# EAGLE design hw6 (EAGLE 9.6.2)
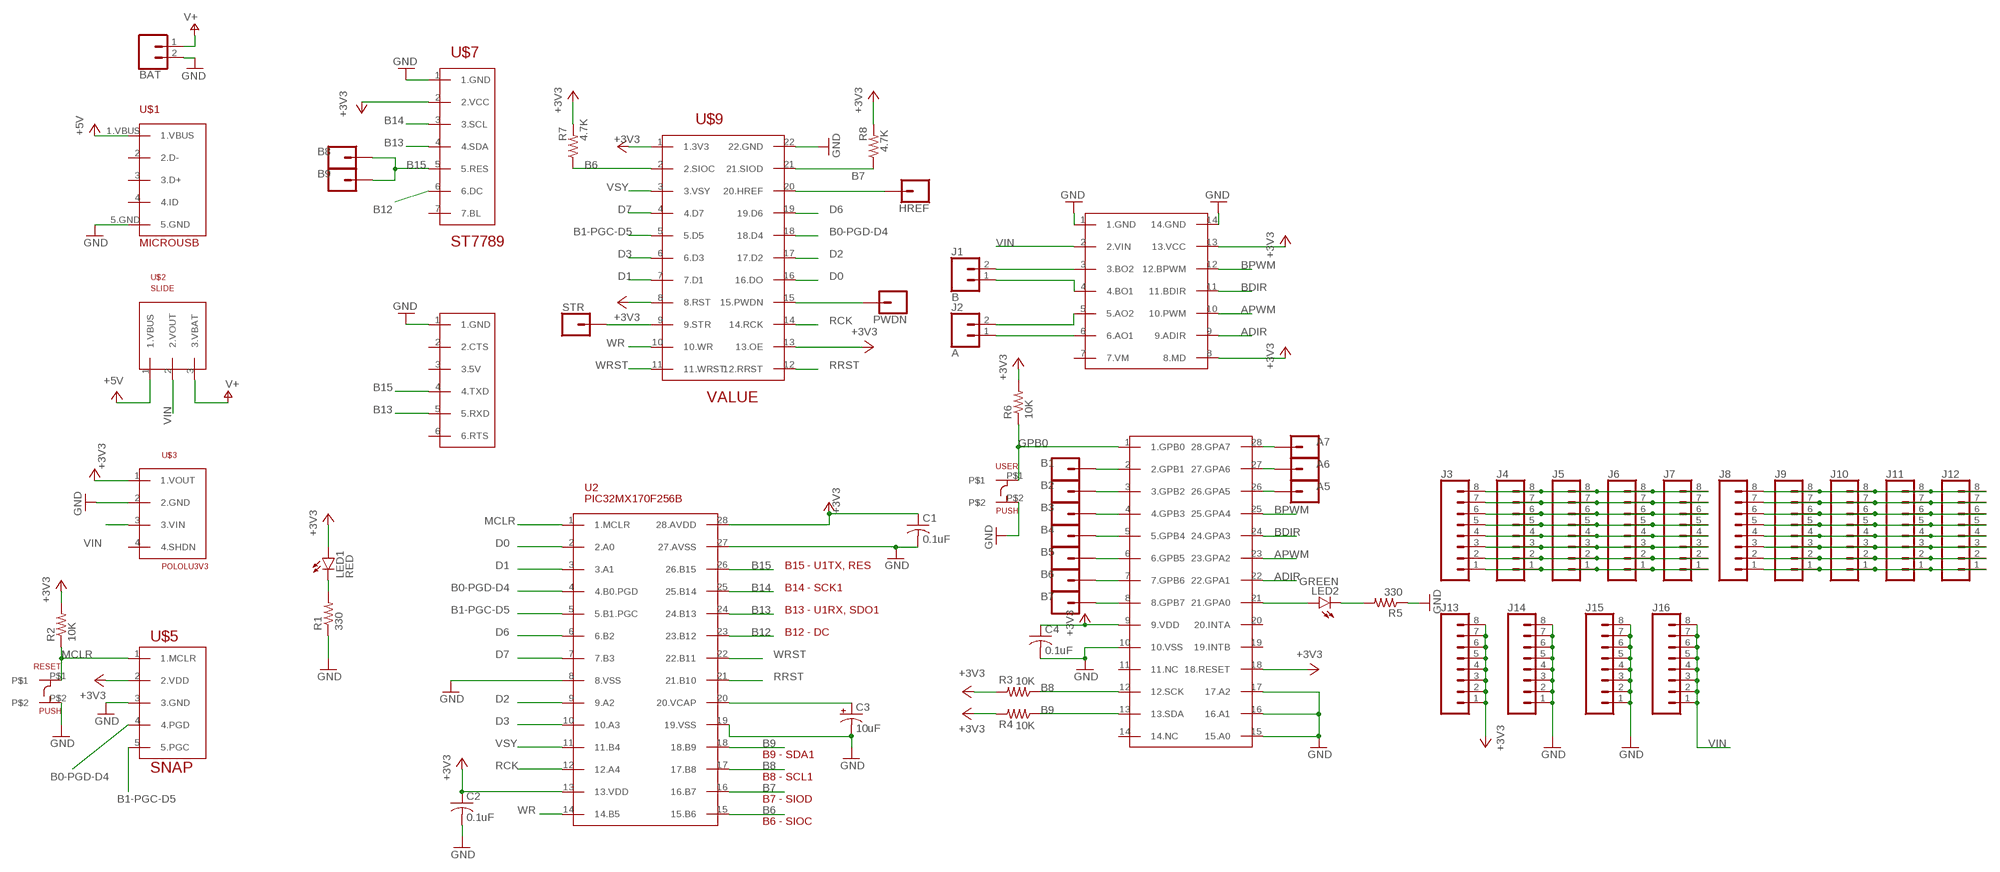
[diagram p0: schematic, sheet 1]

## Parts
A5  CONN_01  [1X01]
A6  CONN_01  [1X01]
A7  CONN_01  [1X01]
B1  CONN_01  [1X01]
B2  CONN_01  [1X01]
B3  CONN_01  [1X01]
B4  CONN_01  [1X01]
B5  CONN_01  [1X01]
B6  CONN_01  [1X01]
B7  CONN_01  [1X01]
B8  CONN_01  [1X01]
B9  CONN_01  [1X01]
BAT  CONN_02  [1X02]
C1  0.1uF  C-US025-030X050  [C025-030X050]
C2  0.1uF  C-US025-030X050  [C025-030X050]
C3  10uF  CPOL-USB45181B  [B45181B]
C4  0.1uF  C-US025-030X050  [C025-030X050]
HREF  CONN_01  [1X01]
J1  B  CONN_02  [1X02]
J2  A  CONN_02  [1X02]
J3  CONN_08"  [1X08]
J4  CONN_08"  [1X08]
J5  CONN_08"  [1X08]
J6  CONN_08"  [1X08]
J7  CONN_08"  [1X08]
J8  CONN_08"  [1X08]
J9  CONN_08"  [1X08]
J10  CONN_08"  [1X08]
J11  CONN_08"  [1X08]
J12  CONN_08"  [1X08]
J13  CONN_08"  [1X08]
J14  CONN_08"  [1X08]
J15  CONN_08"  [1X08]
J16  CONN_08"  [1X08]
LED1  RED  LED3MM  [LED3MM]
LED2  GREEN  LED3MM  [LED3MM]
PWDN  CONN_01  [1X01]
R1  330  R-US_0207/10  [0207/10]
R2  10K  R-US_0207/10  [0207/10]
R3  10K  R-US_0207/10  [0207/10]
R4  10K  R-US_0207/10  [0207/10]
R5  330  R-US_0207/10  [0207/10]
R6  10K  R-US_0207/10  [0207/10]
R7  4.7K  R-US_0207/10  [0207/10]
R8  4.7K  R-US_0207/10  [0207/10]
RESET  PUSH  [PUSH]
STR  CONN_01  [1X01]
U2  PIC32MX170F256B  [DIL28-3]
U$1  MICROUSB  [MICROUSB]
U$2  SLIDE  [SLIDE]
U$3  POLOLU3V3  [POLOLU3V3]
U$4  DRV8835  [DRV8835]
U$5  SNAP  [SNAP]
U$6  CP2104_FRIEND  [CP2104_FRIEND]
U$7  ST7789  [ST7789]
U$8  MCP23017  [DIL28-3]
U$9  OV7670FIFO  [OV7670FIFO]
USER  PUSH  [PUSH]

## Nets
+3V3: C1.1 C2.1 C4.1 J13.1 J13.2 J13.3 J13.4 J13.5 J13.6 J13.7 J13.8 LED1.A R2.2 R3.2 R4.2 R6.2 R7.2 R8.2 U2.13(13.VDD) U2.28(28.AVDD) U$3.1(1.VOUT) U$4.8(8.MD) U$4.13(13.VCC) U$5.2(2.VDD) U$7.2(2.VCC) U$8.9(9.VDD) U$8.18(18.RESET) U$9.1(1.3V3) U$9.8(8.RST) U$9.13(13.OE)
+5V: U$1.1.VBUS U$2.1(1.VBUS)
ADIR: U$4.9(9.ADIR) U$8.22(22.GPA1)
APWM: U$4.10(10.PWM) U$8.23(23.GPA2)
B0-PGD-D4: U2.4(4.B0.PGD) U$5.4(4.PGD) U$9.18(18.D4)
B1-PGC-D5: U2.5(5.B1.PGC) U$5.5(5.PGC) U$9.5(5.D5)
B6: R7.1 U2.15(15.B6) U$9.2(2.SIOC)
B7: R8.1 U2.16(16.B7) U$9.21(21.SIOD)
B8: R3.1 U2.17(17.B8) U$8.12(12.SCK)
B9: R4.1 U2.18(18.B9) U$8.13(13.SDA)
B12: U2.23(23.B12) U$7.6(6.DC)
B13: U2.24(24.B13) U$6.5(5.RXD) U$7.4(4.SDA)
B14: U2.25(25.B14) U$7.3(3.SCL)
B15: B8.1 B9.1 U2.26(26.B15) U$6.4(4.TXD) U$7.5(5.RES)
BDIR: U$4.11(11.BDIR) U$8.24(24.GPA3)
BPWM: U$4.12(12.BPWM) U$8.25(25.GPA4)
D0: U2.2(2.A0) U$9.16(16.DO)
D1: U2.3(3.A1) U$9.7(7.D1)
D2: U2.9(9.A2) U$9.17(17.D2)
D3: U2.10(10.A3) U$9.6(6.D3)
D6: U2.6(6.B2) U$9.19(19.D6)
D7: U2.7(7.B3) U$9.4(4.D7)
GND: BAT.2 C1.2 C2.2 C3.- C4.2 J14.1 J14.2 J14.3 J14.4 J14.5 J14.6 J14.7 J14.8 J15.1 J15.2 J15.3 J15.4 J15.5 J15.6 J15.7 J15.8 R1.1 R5.1 RESET.P$2 U2.8(8.VSS) U2.19(19.VSS) U2.27(27.AVSS) U$1.5.GND U$3.2(2.GND) U$4.1(1.GND) U$4.14(14.GND) U$5.3(3.GND) U$6.1(1.GND) U$7.1(1.GND) U$8.10(10.VSS) U$8.15(15.A0) U$8.16(16.A1) U$8.17(17.A2) U$9.22(22.GND) USER.P$2
GPB0: R6.1 U$8.1(1.GPB0) USER.P$1
MCLR: R2.1 RESET.P$1 U2.1(1.MCLR) U$5.1(1.MCLR)
N$1: LED1.K(C) R1.2
N$2: C3.+ U2.20(20.VCAP)
N$3: LED2.K(C) R5.2
N$4: LED2.A U$8.21(21.GPA0)
N$5: J1.2 U$4.3(3.BO2)
N$6: J1.1 U$4.4(4.BO1)
N$7: J2.2 U$4.5(5.AO2)
N$8: J2.1 U$4.6(6.AO1)
N$9: STR.1 U$9.9(9.STR)
N$10: HREF.1 U$9.20(20.HREF)
N$11: PWDN.1 U$9.15(15.PWDN)
N$12: B1.1 U$8.2(2.GPB1)
N$13: B2.1 U$8.3(3.GPB2)
N$14: B3.1 U$8.4(4.GPB3)
N$15: B4.1 U$8.5(5.GPB4)
N$16: B5.1 U$8.6(6.GPB5)
N$17: B6.1 U$8.7(7.GPB6)
N$18: B7.1 U$8.8(8.GPB7)
N$19: A7.1 U$8.28(28.GPA7)
N$20: A6.1 U$8.27(27.GPA6)
N$21: A5.1 U$8.26(26.GPA5)
N$22: J3.8 J4.8 J5.8 J6.8 J7.8
N$23: J3.7 J4.7 J5.7 J6.7 J7.7
N$24: J3.6 J4.6 J5.6 J6.6 J7.6
N$25: J3.5 J4.5 J5.5 J6.5 J7.5
N$26: J3.4 J4.4 J5.4 J6.4 J7.4
N$27: J3.3 J4.3 J5.3 J6.3 J7.3
N$28: J3.2 J4.2 J5.2 J6.2 J7.2
N$29: J3.1 J4.1 J5.1 J6.1 J7.1
N$30: J8.8 J9.8 J10.8 J11.8 J12.8
N$31: J8.7 J9.7 J10.7 J11.7 J12.7
N$32: J8.6 J9.6 J10.6 J11.6 J12.6
N$33: J8.5 J9.5 J10.5 J11.5 J12.5
N$34: J8.4 J9.4 J10.4 J11.4 J12.4
N$35: J8.3 J9.3 J10.3 J11.3 J12.3
N$36: J8.2 J9.2 J10.2 J11.2 J12.2
N$37: J8.1 J9.1 J10.1 J11.1 J12.1
RCK: U2.12(12.A4) U$9.14(14.RCK)
RRST: U2.21(21.B10) U$9.12(12.RRST)
V+: BAT.1 U$2.3(3.VBAT)
VIN: J16.1 J16.2 J16.3 J16.4 J16.5 J16.6 J16.7 J16.8 U$2.2(2.VOUT) U$3.3(3.VIN) U$4.2(2.VIN)
VSY: U2.11(11.B4) U$9.3(3.VSY)
WR: U2.14(14.B5) U$9.10(10.WR)
WRST: U2.22(22.B11) U$9.11(11.WRST)
Unconnected: U$1.2(2.D-) U$1.3(3.D+) U$1.4(4.ID) U$3.4(4.SHDN) U$4.7(7.VM) U$6.2(2.CTS) U$6.3(3.5V) U$6.6(6.RTS) U$7.7(7.BL) U$8.11(11.NC) U$8.14(14.NC) U$8.19(19.INTB) U$8.20(20.INTA)

## Notes on the sheet
- B15 - U1TX, RES
- B14 - SCK1
- B13 - U1RX, SDO1
- B12 - DC
- B9 - SDA1
- B8 - SCL1
- B7 - SIOD
- B6 - SIOC

## Library data of the parts
A5-A7 B1-B9 HREF PWDN STR = ME433:CONN_01: Single connection point. Often used as Generic Header-pin footprint for 0.1 inch spaced/style header connections On any of the 0.1 inch spaced packages, you can populate with these: Break Away Headers - Straight <https://www.sparkfun.com/products/116> (PRT-00116) Break Away Male Headers - Right Angle <https://www.sparkfun.com/products/553> (PRT-00553) Female Headers <https://www.sparkfun.com/products/115> (PRT-00115) Break Away Headers - Machine Pin <https://www.sparkfun.com/products/117> (PRT-00117) Break Away Female Headers - Swiss Machine Pin <https://www.sparkfun.com/products/743> (PRT-00743) This device is also useful as a general connection point to wire up your design to another part of your project. Our various solder wires solder well into these plated through hole pads. Hook-Up Wire - Assortment (Stranded, 22 AWG) <https://www.sparkfun.com/products/11375> (PRT-11375) Hook-Up Wire - Assortment (Solid Core, 22 AWG) <https://www.sparkfun.com/products/11367> (PRT-11367) View the entire wire category on our website here <https://www.sparkfun.com/categories/141> Special notes: SMTSO-256-ET is a "flush mount" nut for a 4-40 screw. We mostly use this on specialty testbeds; it is a nice way to connect hardware to your PCB at an adjustable hieght. Also note, the SNAP packages are for using a snappable style connector. We sell a baggie of snaps and they are also used on two LilyPad designs: Snap Assortment - 30 pack (male and female) <https://www.sparkfun.com/products/11347> (DEV-11347) LilyPad Arduino SimpleSnap <https://www.sparkfun.com/products/10941> (DEV-10941) LilyPad SimpleSnap Protoboard <https://www.sparkfun.com/products/10940> (DEV-10940)
BAT J1 J2 = ME433:CONN_02: Multi connection point. Often used as Generic Header-pin footprint for 0.1 inch spaced/style header connections On any of the 0.1 inch spaced packages, you can populate with these: Break Away Headers - Straight <https://www.sparkfun.com/products/116> (PRT-00116) Break Away Male Headers - Right Angle <https://www.sparkfun.com/products/553> (PRT-00553) Female Headers <https://www.sparkfun.com/products/115> (PRT-00115) Break Away Headers - Machine Pin <https://www.sparkfun.com/products/117> (PRT-00117) Break Away Female Headers - Swiss Machine Pin <https://www.sparkfun.com/products/743> (PRT-00743) For SCREWTERMINALS and SPRING TERMINALS visit here: Screw Terimnals on SparkFun.com <https://www.sparkfun.com/search/results?term=Screw+Terminals> (5mm/3.5mm/2.54mm spacing) This device is also useful as a general connection point to wire up your design to another part of your project. Our various solder wires solder well into these plated through hole pads. Hook-Up Wire - Assortment (Stranded, 22 AWG) <https://www.sparkfun.com/products/11375> (PRT-11375) Hook-Up Wire - Assortment (Solid Core, 22 AWG) <https://www.sparkfun.com/products/11367> (PRT-11367) View the entire wire category on our website here <https://www.sparkfun.com/categories/141> Special notes: Molex polarized connector foot print use with: PRT-08233 with associated crimp pins and housings. 2.54_SCREWTERM for use with PRT-10571. 3.5mm Screw Terminal footprints for PRT-08084 5mm Screw Terminal footprints for use with PRT-08432
C1 C2 C4 = ME433:C-US: CAPACITOR, American symbol; SPICEPREFIX: C
C3 = ME433:CPOL-US: POLARIZED CAPACITOR, American symbol; SPICEPREFIX: C
J3-J16 = ME433:CONN_08: Multi connection point. Often used as Generic Header-pin footprint for 0.1 inch spaced/style header connections On any of the 0.1 inch spaced packages, you can populate with these: Break Away Headers - Straight <https://www.sparkfun.com/products/116> (PRT-00116) Break Away Male Headers - Right Angle <https://www.sparkfun.com/products/553> (PRT-00553) Female Headers <https://www.sparkfun.com/products/115> (PRT-00115) Break Away Headers - Machine Pin <https://www.sparkfun.com/products/117> (PRT-00117) Break Away Female Headers - Swiss Machine Pin <https://www.sparkfun.com/products/743> (PRT-00743) Arduino Stackable Header - 8 Pin <https://www.sparkfun.com/products/9279> (PRT-09279) For SCREWTERMINALS and SPRING TERMINALS visit here: Screw Terimnals on SparkFun.com <https://www.sparkfun.com/search/results?term=Screw+Terminals> (5mm/3.5mm/2.54mm spacing) This device is also useful as a general connection point to wire up your design to another part of your project. Our various solder wires solder well into these plated through hole pads. Hook-Up Wire - Assortment (Stranded, 22 AWG) <https://www.sparkfun.com/products/11375> (PRT-11375) Hook-Up Wire - Assortment (Solid Core, 22 AWG) <https://www.sparkfun.com/products/11367> (PRT-11367) View the entire wire category on our website here <https://www.sparkfun.com/categories/141> Special notes: Molex polarized connector foot print use with SKU : PRT-08231 with associated crimp pins and housings. 1MM SMD Version SKU: PRT-10208 NOTES ON THE VARIANTS LOCK and LOCK_LONGPADS... This footprint was designed to help hold the alignment of a through-hole component (i.e. 6-pin header) while soldering it into place. You may notice that each hole has been shifted either up or down by 0.005 of an inch from it's more standard position (which is a perfectly straight line). This slight alteration caused the pins (the squares in the middle) to touch the edges of the holes. Because they are alternating, it causes a "brace" to hold the component in place. 0.005 has proven to be the perfect amount of "off-center" position when using our standard breakaway headers. Although looks a little odd when you look at the bare footprint, once you have a header in there, the alteration is very hard to notice. Also,if you push a header all the way into place, it is covered up entirely on the bottom side.; PROD_ID: CONN-08438
LED1 LED2 = ME433:LED: LED OSRAM: - CHIPLED LG R971, LG N971, LY N971, LG Q971, LY Q971, LO R971, LY R971 LH N974, LH R974 LS Q976, LO Q976, LY Q976 LO Q996 - Hyper CHIPLED LW Q18S LB Q993, LB Q99A, LB R99A - SideLED LS A670, LO A670, LY A670, LG A670, LP A670 LB A673, LV A673, LT A673, LW A673 LH A674 LY A675 LS A676, LA A676, LO A676, LY A676, LW A676 LS A679, LY A679, LG A679 - Hyper Micro SIDELED® LS Y876, LA Y876, LO Y876, LY Y876 LT Y87S - SmartLED LW L88C, LW L88S LB L89C, LB L89S, LG L890 LS L89K, LO L89K, LY L89K LS L896, LA L896, LO L896, LY L896 - TOPLED LS T670, LO T670, LY T670, LG T670, LP T670 LSG T670, LSP T670, LSY T670, LOP T670, LYG T670 LG T671, LOG T671, LSG T671 LB T673, LV T673, LT T673, LW T673 LH T674 LS T676, LA T676, LO T676, LY T676, LB T676, LH T676, LSB T676, LW T676 LB T67C, LV T67C, LT T67C, LS T67K, LO T67K, LY T67K, LW E67C LS E67B, LA E67B, LO E67B, LY E67B, LB E67C, LV E67C, LT E67C LW T67C LS T679, LY T679, LG T679 LS T770, LO T770, LY T770, LG T770, LP T770 LB T773, LV T773, LT T773, LW T773 LH T774 LS E675, LA E675, LY E675, LS T675 LS T776, LA T776, LO T776, LY T776, LB T776 LHGB T686 LT T68C, LB T68C - Hyper Mini TOPLED® LB M676 - Mini TOPLED Santana® LG M470 LS M47K, LO M47K, LY M47K Source: http://www.osram.convergy.de LUXEON: - LUMILED® LXK2-PW12-R00, LXK2-PW12-S00, LXK2-PW14-U00, LXK2-PW14-V00 LXK2-PM12-R00, LXK2-PM12-S00, LXK2-PM14-U00 LXK2-PE12-Q00, LXK2-PE12-R00, LXK2-PE12-S00, LXK2-PE14-T00, LXK2-PE14-U00 LXK2-PB12-K00, LXK2-PB12-L00, LXK2-PB12-M00, LXK2-PB14-N00, LXK2-PB14-P00, LXK2-PB14-Q00 LXK2-PR12-L00, LXK2-PR12-M00, LXK2-PR14-Q00, LXK2-PR14-R00 LXK2-PD12-Q00, LXK2-PD12-R00, LXK2-PD12-S00 LXK2-PH12-R00, LXK2-PH12-S00 LXK2-PL12-P00, LXK2-PL12-Q00, LXK2-PL12-R00 Source: www.luxeon.com KINGBRIGHT: KA-3528ASYC Source: www.kingbright.com
R1-R8 = ME433:R-US_: RESISTOR, American symbol; SPICEPREFIX: R
RESET USER = ME433:PUSH
U2 = ME433:PIC32MX170F256B
U$1 = ME433:MICROUSB
U$2 = ME433:SLIDE
U$3 = ME433:POLOLU3V3
U$4 = ME433:DRV8835
U$5 = ME433:SNAP
U$6 = ME433:CP2104_FRIEND
U$7 = ME433:ST7789
U$8 = ME433:MCP23017
U$9 = ME433:OV7670FIFO

## Board
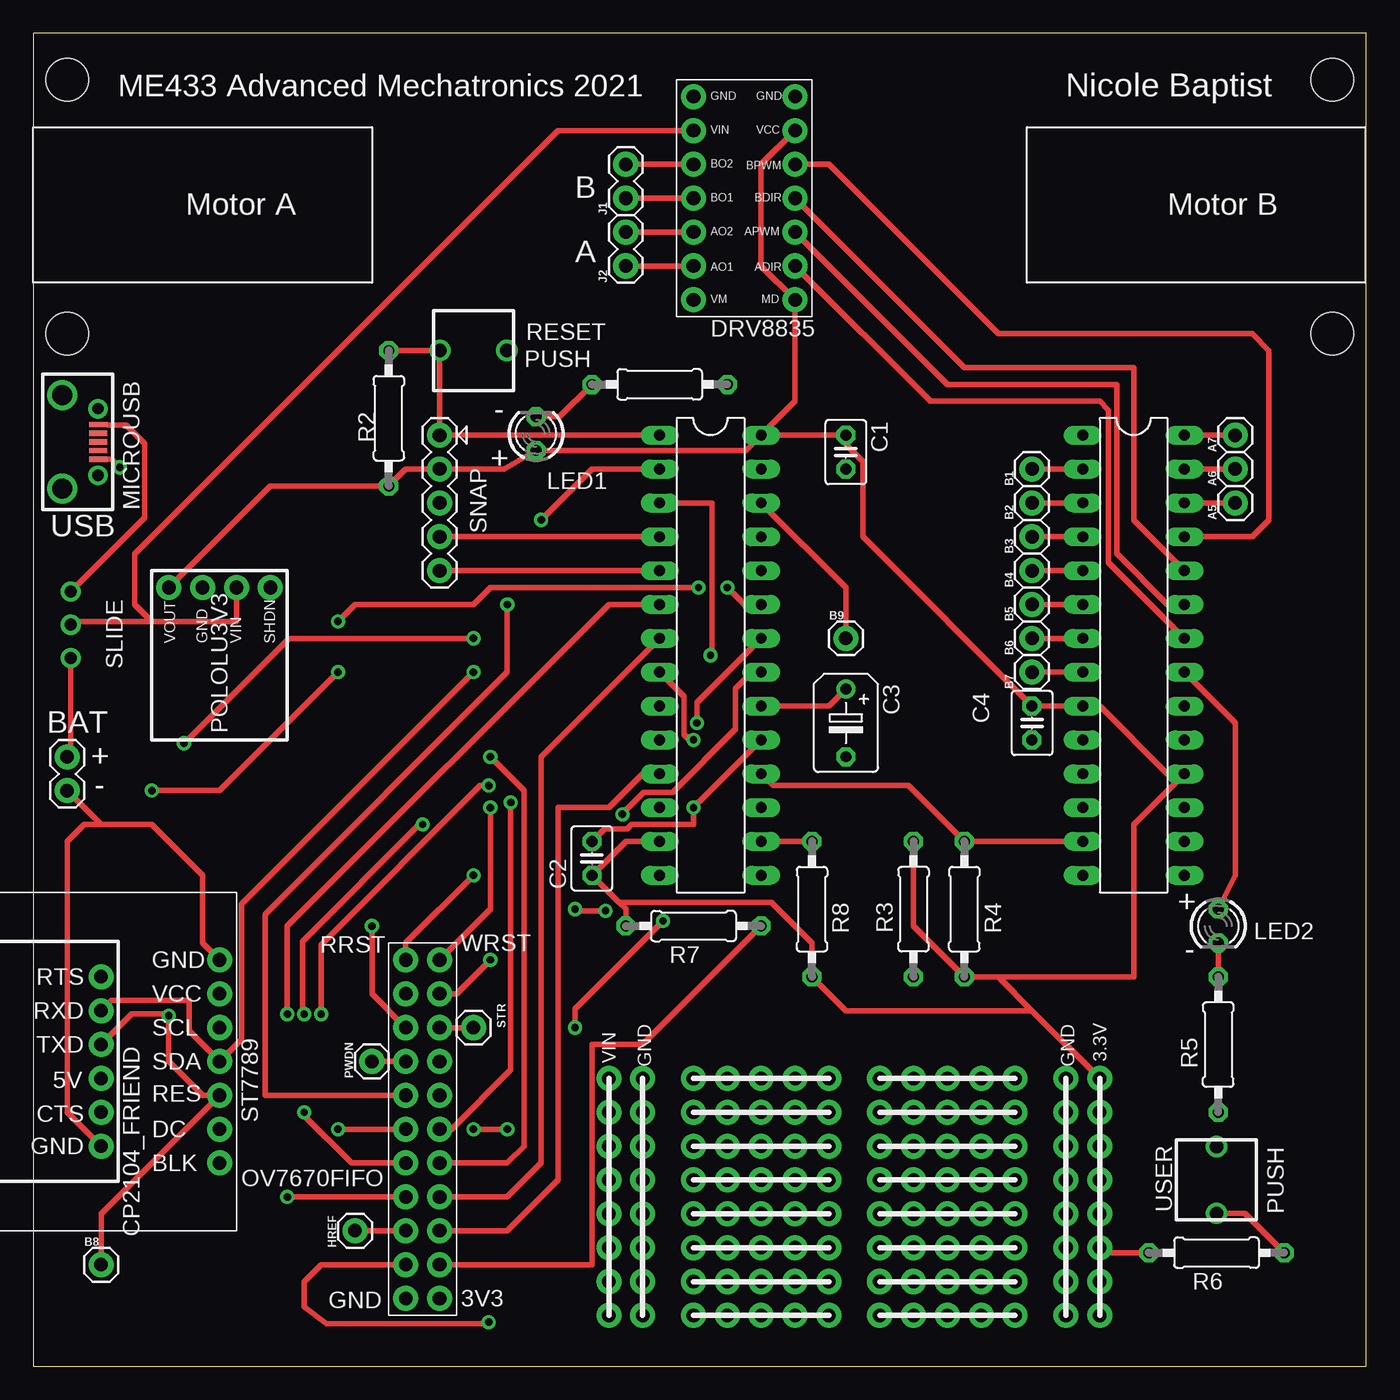
[diagram p1: board, top side]
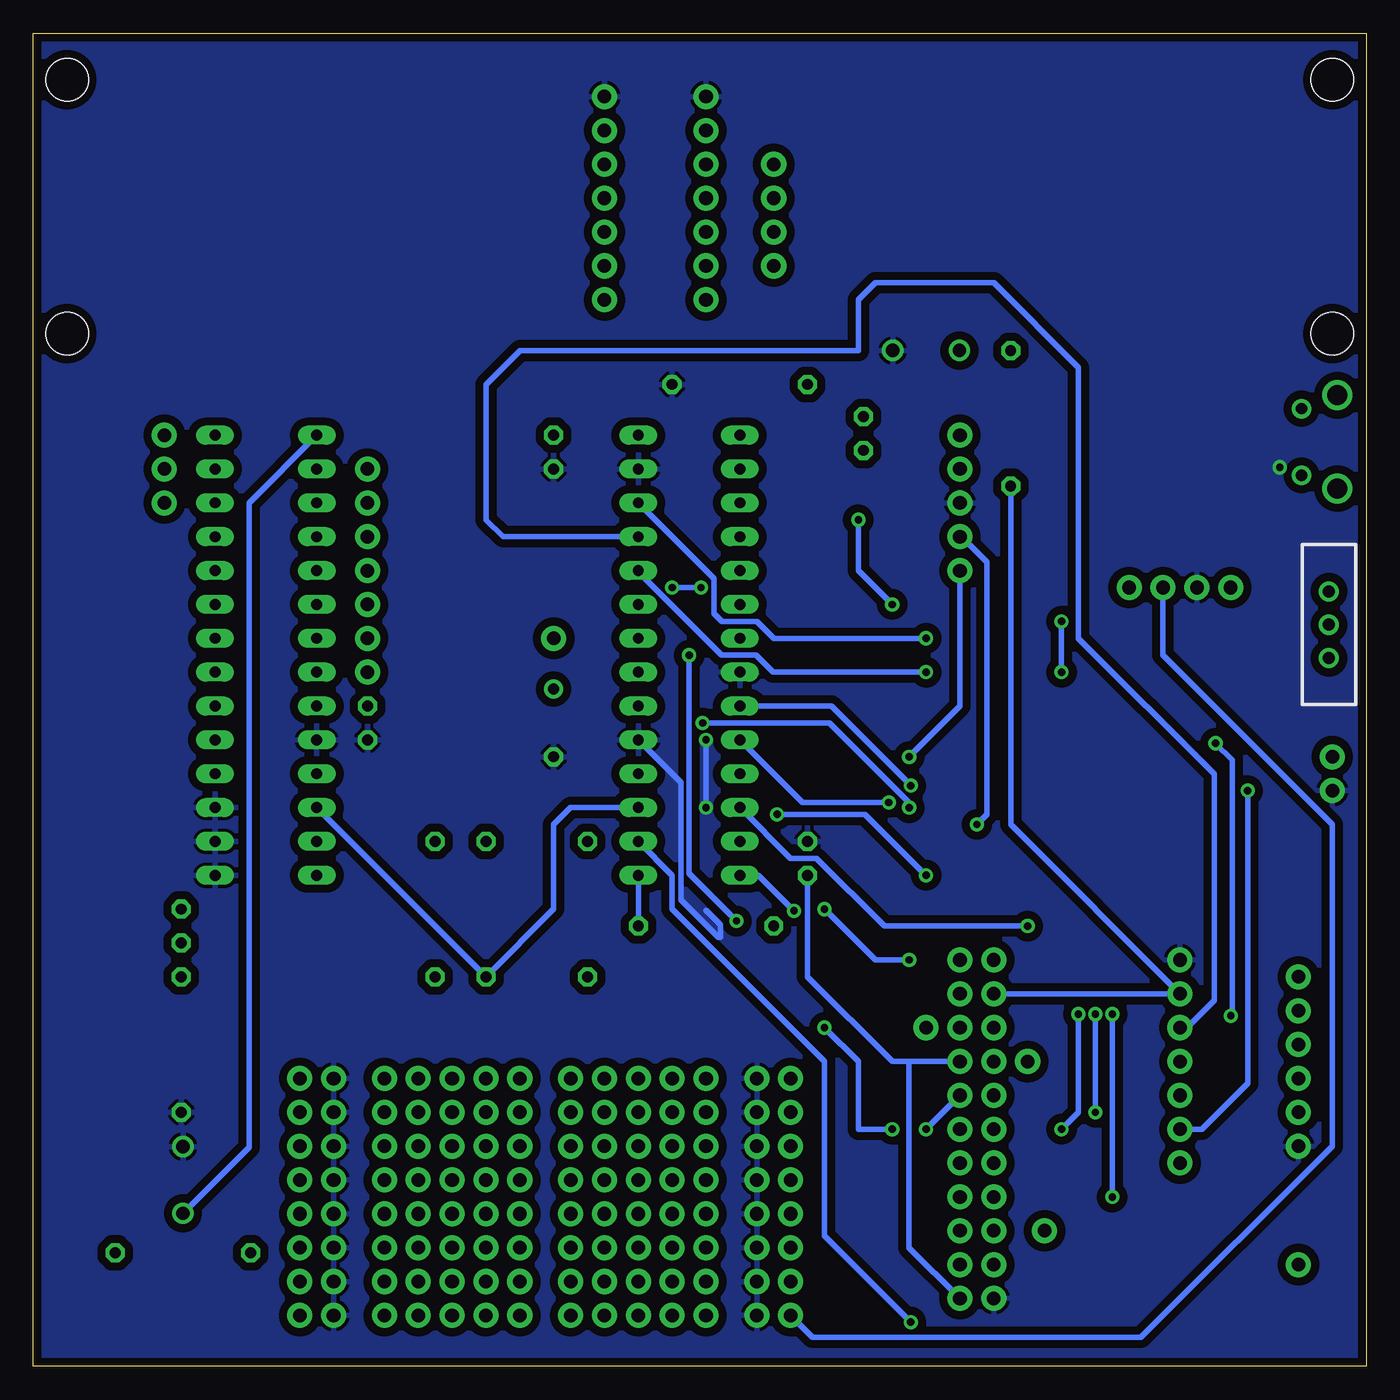
[diagram p2: board, bottom side, seen from below]

Size 100 x 100 mm. Coordinates in mm from the lower left corner, seen from the top.
Outline: 0,0 100,0 100,100 0,100 0,0
Copper layers (1*16): Top 0.035mm / dielectric 1.5mm / Bottom 0.035mm
Design rules "SparkFun": minimum track width 8mil, minimum drill 20mil, track to track 8mil, track to pad 8mil, pad to pad 8mil, via to via 8mil, smd to smd 8mil, copper to edge 8mil, drill to drill 8mil, minimum pad ring 12mil, minimum via ring 10mil, stop-mask expansion 4mil, vias tented up to drill 20mil, thermal gap 10mil
Holes 3.17 mm at 2.54,96.52 2.54,77.47 97.46,96.52 97.46,77.47

### Footprints (pad centres in the part's own frame; a part is rotated, then mirrored left to right if it is on the bottom)
1X01 = drill 1.016 pad 1.88: 1 0,0
1X02 = drill 1.016 pad 1.88: 1 0,0; 2 2.54,0
C025-030X050 = drill 0.813 octagon: 1 -1.27,0; 2 1.27,0
B45181B = drill 0.813: + -2.54,0 | drill 0.813 octagon: - 2.54,0
1X08 = drill 1.016 pad 1.88: 1 0,0; 2 2.54,0; 3 5.08,0; 4 7.62,0; 5 10.16,0; 6 12.7,0; 7 15.24,0; 8 17.78,0
LED3MM = drill 0.813 octagon: A -1.27,0; K 1.27,0
0207/10 = drill 0.813 octagon: 1 -5.08,0; 2 5.08,0
PUSH = drill 1: P$1 -2.5,0; P$2 2.5,0
DIL28-3 = drill 0.813 long: 1 -16.51,-3.81; 2 -13.97,-3.81; 3 -11.43,-3.81; 4 -8.89,-3.81; 5 -6.35,-3.81; 6 -3.81,-3.81; 7 -1.27,-3.81; 8 1.27,-3.81; 9 3.81,-3.81; 10 6.35,-3.81; 11 8.89,-3.81; 12 11.43,-3.81; 13 13.97,-3.81; 14 16.51,-3.81; 15 16.51,3.81; 16 13.97,3.81; 17 11.43,3.81; 18 8.89,3.81; 19 6.35,3.81; 20 3.81,3.81; 21 1.27,3.81; 22 -1.27,3.81; 23 -3.81,3.81; 24 -6.35,3.81; 25 -8.89,3.81; 26 -11.43,3.81; 27 -13.97,3.81; 28 -16.51,3.81
MICROUSB = smd 0.4 x 1.35: 1.VBUS -1.3,2.7; 2 -0.65,2.7; 3 0,2.7; 4 0.65,2.7; 5.GND 1.3,2.7 | drill 0.85: P$6 -2.5,2.7; P$7 2.5,2.7 | drill 1.5: P$8 -3.5,0; P$9 3.5,0
SLIDE = drill 0.9: 1 -2.5,0; 2 0,0; 3 2.5,0
POLOLU3V3 = drill 1.016 pad 1.88: 1 0,3.81; 2 0,1.27; 3 0,-1.27; 4 0,-3.81
DRV8835 = drill 1.016 pad 1.88: 1 -3.81,7.62; 2 -3.81,5.08; 3 -3.81,2.54; 4 -3.81,0; 5 -3.81,-2.54; 6 -3.81,-5.08; 7 -3.81,-7.62; 8 3.81,-7.62; 9 3.81,-5.08; 10 3.81,-2.54; 11 3.81,0; 12 3.81,2.54; 13 3.81,5.08; 14 3.81,7.62
SNAP = drill 1.016 pad 1.88: 1 0,5.08; 2 0,2.54; 3 0,0; 4 0,-2.54; 5 0,-5.08
CP2104_FRIEND = drill 1.016 pad 1.88: 1 -12.7,21.59; 2 -12.7,19.05; 3 -12.7,16.51; 4 -12.7,13.97; 5 -12.7,11.43; 6 -12.7,8.89
ST7789 = drill 1.016 pad 1.88: 1 0,7.62; 2 0,5.08; 3 0,2.54; 4 0,0; 5 0,-2.54; 6 0,-5.08; 7 0,-7.62
OV7670FIFO = drill 1.016 pad 1.88: 1 -3.81,12.7; 2 -3.81,10.16; 3 -3.81,7.62; 4 -3.81,5.08; 5 -3.81,2.54; 6 -3.81,0; 7 -3.81,-2.54; 8 -3.81,-5.08; 9 -3.81,-7.62; 10 -3.81,-10.16; 11 -3.81,-12.7; 12 -1.27,-12.7; 13 -1.27,-10.16; 14 -1.27,-7.62; 15 -1.27,-5.08; 16 -1.27,-2.54; 17 -1.27,0; 18 -1.27,2.54; 19 -1.27,5.08; 20 -1.27,7.62; 21 -1.27,10.16; 22 -1.27,12.7

### Placement (x,y rotation side)
A5  90.17,64.77 90 top
A6  90.17,67.31 90 top
A7  90.17,69.85 90 top
B1  74.93,67.31 90 top
B2  74.93,64.77 90 top
B3  74.93,62.23 90 top
B4  74.93,59.69 90 top
B5  74.93,57.15 90 top
B6  74.93,54.61 90 top
B7  74.93,52.07 90 top
B8  5.08,7.62 0 top
B9  60.96,54.61 0 top
BAT  2.54,45.72 270 top
C1  60.96,68.58 270 top
C2  41.91,38.1 90 top
C3  60.96,48.26 270 top
C4  74.93,48.26 270 top
HREF  24.13,10.16 90 top
J1  44.45,87.63 90 top
J2  44.45,82.55 90 top
J3  49.53,3.81 90 top
J4  52.07,3.81 90 top
J5  54.61,3.81 90 top
J6  57.15,3.81 90 top
J7  59.69,3.81 90 top
J8  63.5,3.81 90 top
J9  66.04,3.81 90 top
J10  68.58,3.81 90 top
J11  71.12,3.81 90 top
J12  73.66,3.81 90 top
J13  80.01,21.59 270 top
J14  77.47,21.59 270 top
J15  45.72,21.59 270 top
J16  43.18,3.81 90 top
LED1  37.72,69.98 90 top
LED2  88.9,33.02 270 top
PWDN  25.4,22.86 90 top
R1  46.99,73.66 180 top
R2  26.67,71.12 270 top
R3  66.04,34.29 90 top
R4  69.85,34.29 270 top
R5  88.9,24.13 90 top
R6  88.77,8.51 180 top
R7  49.53,33.02 180 top
R8  58.42,34.29 270 top
RESET  33.02,76.2 0 top
STR  33.02,25.4 90 top
U2  50.8,53.34 270 top
U$1  2.16,69.34 270 top
U$2  2.79,55.63 270 bottom
U$3  13.97,58.42 90 top
U$4  53.34,87.63 0 top
U$5  30.48,64.77 0 top
U$6  -7.62,38.1 180 top
U$7  13.97,22.86 0 top
U$8  82.55,53.34 270 top
U$9  26.67,17.78 180 top
USER  88.77,13.97 90 top

### Tracks (layer width: path | path; a pad name or v marks a point on that pad's centre or on a via)
+3V3
  Top 0.406: U$3.1 17.78,66.04 R2.2 27.94,67.31 U$5.2 35.31,67.31 LED1.A 53.47,68.71 U2.28 | U2.28 C1.1 60.96,69.13 62.23,67.86 62.23,62.23 C4.1 U$8.9 80.01,49.53 85.09,44.45 U$8.18 82.55,40.64 82.55,29.21 R4.2 | U2.28 57.15,72.39 U$4.8 54.61,82.55 54.61,90.17 U$4.13 | R3.2 66.04,33.02 R4.2 | R4.2 72.39,29.21 74.93,26.67 | 74.93,26.67 J13.1 J13.2 J13.3 J13.4 J13.5 J13.6 | R6.2 80.39,8.51 J13.6 | 43.94,34.8 C2.1 44.45,39.37 U2.13 | 43.94,34.8 44.45,34.29 R7.2 | 43.94,34.8 55.37,34.8 58.42,31.75 R8.2 60.96,26.67 74.93,26.67 | J13.6 J13.7 J13.8
  Bottom 0.406: C2.1 41.91,29.21 35.56,22.86 34.29,22.86 | 34.29,22.86 U$9.8 | U$9.1 34.29,8.89 34.29,22.86 | R2.2 26.67,40.64 U$7.2 U$9.13
+5V
  Top 0.406: U$2.1 8.35,63.69 8.35,69.22 6.97,70.6 5.6,70.6 5.56,70.64 U$1.1.VBUS
ADIR
  Top 0.406: U$8.22 80.67,60.3 80.67,71.73 80.01,72.39 67.31,72.39 U$4.9
APWM
  Top 0.406: U$8.23 85.09,57.15 81.28,60.96 81.28,73.66 68.58,73.66 U$4.10
B0-PGD-D4  (via drill 0.55)
  Top 0.406: U$5.4 U2.4 | U$9.18 23.88,15.24 20.32,18.8 v20.32,19.05 | v20.32,26.42 20.19,26.54 20.19,31.88 28.96,40.64 v29.21,40.64
  Bottom 0.406: v20.32,26.42 v20.32,19.05 | v29.21,40.64 28.45,41.4 28.45,60.33 30.35,62.23 U$5.4
B1-PGC-D5  (via drill 0.55)
  Top 0.406: U2.5 U$5.5 | U$9.5 35.56,15.24 36.83,16.51 36.83,43.18 v34.29,45.72
  Bottom 0.406: v34.29,45.72 30.48,49.53 U$5.5
B6
  Top 0.406: R7.1 45.72,24.13 41.91,24.13 41.91,7.62 U$9.2
  Bottom 0.406: U2.15 R7.1
B7  (via drill 0.55)
  Top 0.406: U2.16 R8.1 | v34.16,3.3 34.04,3.17 22.01,3.17 20.32,4.45 20.32,6.35 21.59,7.62 U$9.21
  Bottom 0.406: U2.16 52.07,36.83 52.07,34.29 40.64,22.86 40.64,9.78 v34.16,3.3
B8
  Bottom 0.406: U$8.12 R3.1 60.96,34.29 60.96,40.64 59.69,41.91 U2.17
B9
  Top 0.406: U2.18 55.5,43.56 65.66,43.56 R4.1 U$8.13
B12  (via drill 0.55)
  Top 0.406: v8.89,43.18 13.97,43.18 v22.86,52.07 | v22.86,55.88 24.13,57.15 33.02,57.15 34.29,58.42 v49.91,58.42 | v52.07,58.42 53.34,57.15 U2.23
  Bottom 0.406: U$7.6 12.32,17.78 8.89,21.21 v8.89,43.18 | v22.86,52.07 v22.86,55.88 | v49.91,58.42 v52.07,58.42
B13  (via drill 0.55)
  Top 0.406: U$6.5 5.84,27.43 11.68,27.43 11.68,25.15 U$7.4 15.65,24.54 15.65,34.7 v33.02,52.07
  Bottom 0.406: U2.24 54.61,59.56 48.39,53.34 45.78,53.34 44.51,52.07 v33.02,52.07
B14
  Bottom 0.406: U2.25 64.77,62.23 66.04,63.5 66.04,73.66 63.5,76.2 38.1,76.2 38.1,80.01 36.83,81.28 27.94,81.28 21.59,74.93 21.59,54.61 11.4,44.42 11.4,27.46 13.46,25.4 U$7.3
B15  (via drill 0.55)
  Top 0.406: U$6.4 7.37,26.42 10.03,26.42 v10.16,26.29 10.16,22.86 12.7,20.32 U$7.5 5.08,11.43 B8.1 | v33.02,54.61 19.18,54.61 v11.3,46.74 | U2.26 60.96,58.42 B9.1
  Bottom 0.406: v33.02,54.61 44.45,54.61 45.72,55.88 48.33,55.88 48.92,56.48 48.92,59.08 U2.26 | v11.3,46.74 10.03,45.47 10.03,26.42 v10.16,26.29
BDIR
  Top 0.406: U$4.11 69.85,74.93 82.55,74.93 82.55,63.5 U$8.24
BPWM
  Top 0.406: U$4.12 59.69,90.17 72.39,77.47 91.44,77.47 92.71,76.2 92.71,63.5 91.44,62.23 U$8.25
D0  (via drill 0.55)
  Top 0.406: U2.2 41.91,67.31 v38.1,63.5 | v35.56,57.15 35.56,52.07 17.4,33.91 17.4,20.32 U$9.16
  Bottom 0.406: v38.1,63.5 38.1,59.69 v35.56,57.15
D1  (via drill 0.55)
  Top 0.406: v35.56,17.78 v33.02,17.78 | v47.24,33.4 40.64,26.8 v40.64,25.4 | v50.8,53.34 50.93,53.47 50.93,64.77 U2.3
  Bottom 0.406: v35.56,17.78 38.1,17.78 38.1,22.86 v40.64,25.4 | U$9.7 v33.02,17.78 | v47.24,33.4 50.8,36.96 v50.8,53.34
D2  (via drill 0.55)
  Top 0.406: U$9.17 v22.86,17.78 | v21.59,26.42 21.59,31.62 33.53,43.56 v34.16,43.56
  Bottom 0.406: v22.86,17.78 21.59,19.05 v21.59,26.42 | v34.16,43.56 40.13,49.53 U2.9
D3  (via drill 0.55)
  Top 0.406: U$9.6 31.37,17.78 35.81,22.23 v35.81,42.29
  Bottom 0.406: v35.81,42.29 42.29,42.29 U2.10
D6  (via drill 0.55)
  Top 0.406: U$9.19 v19.05,12.7 | v19.05,26.42 19.05,33.02 43.18,57.15 U2.6
  Bottom 0.406: v19.05,26.42 v19.05,12.7
D7
  Top 0.406: U$9.4 35.56,12.7 38.1,15.24 38.1,45.72 U2.7
GND  (via drill 0.55)
  Top 0.406: U$1.5.GND 5.87,68.04 v6.48,67.44 | U$7.1 12.7,31.75 12.7,36.83 8.89,40.64 5.08,40.64 | 5.08,40.64 BAT.2 | U$6.1 2.54,19.05 2.54,39.37 3.81,40.64 5.08,40.64 | v49.53,46.99 49.24,46.99 48.82,47.41 48.82,50.24 U2.8 | C2.2 42.85,40.31 44.54,40.31 44.87,40.64 49.53,40.64 v49.53,41.91 U2.19
  Bottom 0.406: U2.19 51.41,43.79 51.41,34.99 48.61,32.19 48.44,32.19 48.44,33.11 49.53,34.2 | v49.53,41.91 v49.53,46.99
  pour Bottom (isolate 0.61): 99.06,0 100.33,0 100.33,100.33 0,100.33 0,0
GPB0
  Top 0.406: R6.1 90.89,11.47 USER.P$1
  Bottom 0.406: USER.P$1 83.82,16.42 83.82,64.77 U$8.1
MCLR
  Top 0.406: R2.1 RESET.P$1 30.48,76.16 U$5.1 U2.1
N$1
  Top 0.406: R1.2 39.5,71.25 LED1.K
N$2
  Top 0.406: C3.+ 59.69,49.53 U2.20
N$3
  Top 0.406: R5.2 LED2.K
N$4
  Top 0.406: LED2.A 90.17,36.83 90.17,48.26 U$8.21
N$5
  Top 0.406: J1.2 U$4.3
N$6
  Top 0.406: J1.1 U$4.4
N$7
  Top 0.406: J2.2 U$4.5
N$8
  Top 0.406: J2.1 U$4.6
N$9
  Top 0.406: U$9.9 STR.1
N$10
  Top 0.406: U$9.20 HREF.1
N$11
  Top 0.406: U$9.15 PWDN.1
N$12
  Top 0.406: U$8.2 B1.1
N$13
  Top 0.406: U$8.3 B2.1
N$14
  Top 0.406: U$8.4 B3.1
N$15
  Top 0.406: U$8.5 B4.1
N$16
  Top 0.406: U$8.6 B5.1
N$17
  Top 0.406: U$8.7 B6.1
N$18
  Top 0.406: U$8.8 B7.1
N$19
  Top 0.406: A7.1 U$8.28
N$20
  Top 0.406: A6.1 U$8.27
N$21
  Top 0.406: A5.1 U$8.26
N$22
  Top 0.406: J3.8 J4.8 J5.8 J6.8 J7.8
N$23
  Top 0.406: J7.7 J6.7 J5.7 J4.7 J3.7
N$24
  Top 0.406: J3.6 J4.6 J5.6 J6.6 J7.6
N$25
  Top 0.406: J7.5 J6.5 J5.5 J4.5 J3.5
N$26
  Top 0.406: J3.4 J4.4 J5.4 J6.4 J7.4
N$27
  Top 0.406: J7.3 J6.3 J5.3 J4.3 J3.3
N$28
  Top 0.406: J3.2 J4.2 J5.2 J6.2 J7.2
N$29
  Top 0.406: J3.1 J4.1 J5.1 J6.1 J7.1
N$30
  Top 0.406: J8.8 J9.8 J10.8 J11.8 J12.8
N$31
  Top 0.406: J12.7 J11.7 J10.7 J9.7 J8.7
N$32
  Top 0.406: J8.6 J9.6 J10.6 J11.6 J12.6
N$33
  Top 0.406: J12.5 J11.5 J10.5 J9.5 J8.5
N$34
  Top 0.406: J8.4 J9.4 J10.4 J11.4 J12.4
N$35
  Top 0.406: J12.3 J11.3 J10.3 J9.3 J8.3
N$36
  Top 0.406: J8.2 J9.2 J10.2 J11.2 J12.2
N$37
  Top 0.406: J12.1 J11.1 J10.1 J9.1 J8.1
RCK  (via drill 0.55)
  Top 0.406: v25.4,33.02 25.4,27.94 U$9.14
  Bottom 0.406: U2.12 43.18,38.1 41.23,38.1 36.16,33.02 v25.4,33.02
RRST  (via drill 0.55)
  Top 0.406: U$9.12 27.94,31.75 v33.02,36.83 | v44.2,41.4 44.2,41.47 45.78,43.05 47.94,43.05 52.68,47.79 52.68,50.84 53.91,52.07 U2.21
  Bottom 0.406: v33.02,36.83 37.59,41.4 v44.2,41.4
V+
  Top 0.406: U$2.3 2.79,45.97 BAT.1
VIN
  Top 0.406: U$4.2 39.37,92.71 7.59,60.94 7.59,59.15 7.62,59.13 7.62,57.15 8.89,55.88 | 8.89,55.88 15.24,55.88 U$3.3 | J16.8 J16.7 | J16.7 J16.5 J16.4 J16.3 J16.2 J16.1 | U$2.2 3.05,55.88 8.89,55.88 | J16.6 J16.7
  Bottom 0.406: U$3.3 15.24,53.34 2.54,40.64 2.54,16.51 16.89,2.16 41.53,2.16 J16.1
VSY
  Top 0.406: U$9.3 35.56,10.16 39.37,13.97 39.37,41.91 43.18,41.91 45.72,44.45 U2.11
WR  (via drill 0.55)
  Top 0.406: U$9.10 31.75,27.94 v34.29,30.48 | v42.93,34.16 40.77,34.16 v40.64,34.29
  Bottom 0.406: v34.29,30.48 36.83,30.48 v40.64,34.29 | v42.93,34.16 45.59,36.83 U2.14
WRST  (via drill 0.55)
  Top 0.406: U$9.11 34.29,34.29 v34.29,41.91 | v49.78,48.26 49.78,49.78 U2.22
  Bottom 0.406: v34.29,41.91 34.29,42.29 40.26,48.26 v49.78,48.26

### Text on the board
tPlace: ME433 Advanced Mechatronics 2021 | Nicole Baptist | B | Motor A | Motor B | A | - | + | USB | BAT | + | - | + | - | GND | GND | VIN | 3.3V